# EAGLE design snes-breakout (EAGLE 7.5.0)
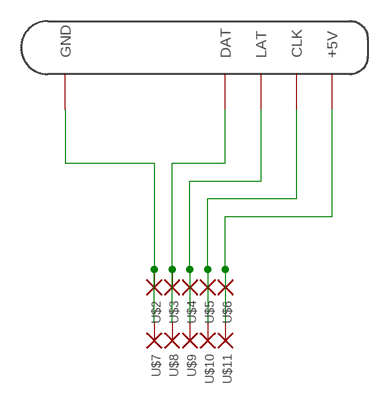
[diagram p0: schematic, sheet 1]

## Parts
U$1  SNES-CONNECTOR  [SNES-CONNECTOR]
U$2  SMDPADSMD6080  [SMD6080]
U$3  SMDPADSMD6080  [SMD6080]
U$4  SMDPADSMD6080  [SMD6080]
U$5  SMDPADSMD6080  [SMD6080]
U$6  SMDPADSMD6080  [SMD6080]
U$7  SMDPADSMD6080  [SMD6080]
U$8  SMDPADSMD6080  [SMD6080]
U$9  SMDPADSMD6080  [SMD6080]
U$10  SMDPADSMD6080  [SMD6080]
U$11  SMDPADSMD6080  [SMD6080]

## Nets
CLK: U$1.P$6(CLK) U$5.P$1(P) U$10.P$1(P)
DAT: U$1.P$4(DAT) U$3.P$1(P) U$8.P$1(P)
GND: U$1.P$1(GND) U$2.P$1(P) U$7.P$1(P)
LAT: U$1.P$5(LAT) U$4.P$1(P) U$9.P$1(P)
VCC: U$1.P$7(+5V) U$6.P$1(P) U$11.P$1(P)

## Library data of the parts
U$1 = munia-breakouts:SNES-CONNECTOR
U$2-U$11 = frank:SMDPAD

## Board
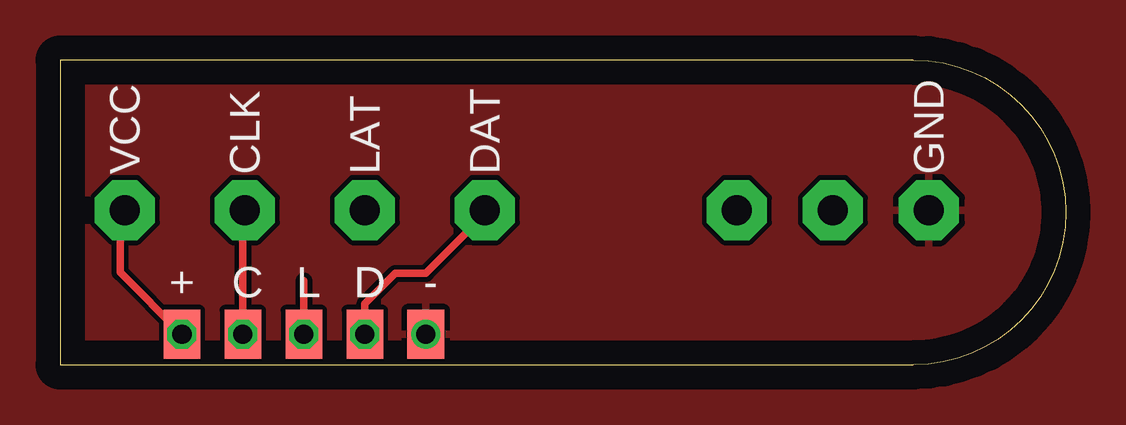
[diagram p1: board, top side]
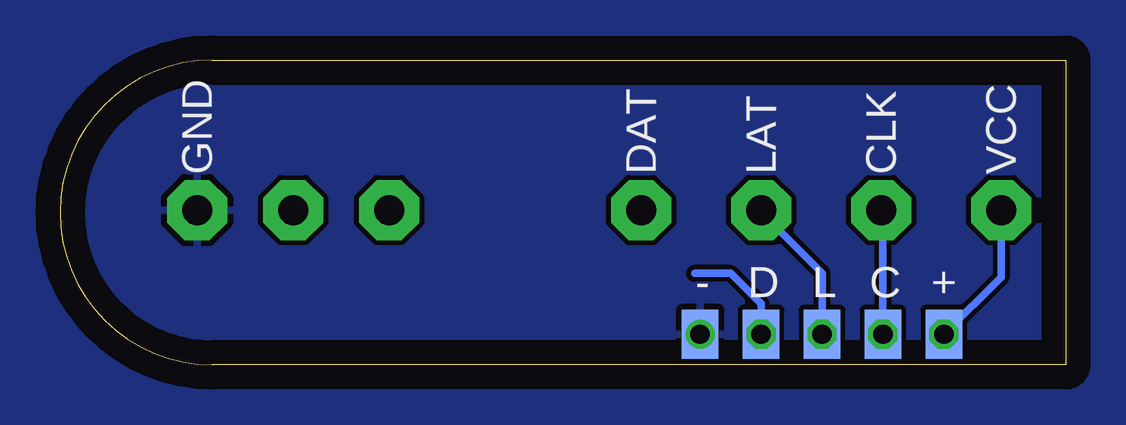
[diagram p2: board, bottom side, seen from below]

Size 41.91 x 12.7 mm. Coordinates in mm from the lower left corner, seen from the top.
Outline: 35.56,12.7 arc-180 35.56,0 0,0 0,12.7 35.56,12.7
Copper layers (1*16): Top 0.035mm / dielectric 1.5mm / Bottom 0.035mm
Design rules "default": minimum track width 10mil, minimum drill 24mil, track to track 8mil, track to pad 8mil, pad to pad 8mil, via to via 8mil, smd to smd 8mil, copper to edge 40mil, drill to drill 8mil, minimum pad ring 10mil, minimum via ring 8mil, stop-mask expansion 4mil, vias tented up to drill 0mil, thermal gap 10mil

### Footprints (pad centres in the part's own frame; a part is rotated, then mirrored left to right if it is on the bottom)
SNES-CONNECTOR = drill 1.25 pad 2.5 octagon: P$1 20,0; P$2 16,0; P$3 12,0; P$4 1.5,0; P$5 -3.5,0; P$6 -8.5,0; P$7 -13.5,0
SMD6080 = smd 1.524 x 2.032: P$1 0,0

### Placement (x,y rotation side)
U$1  16.2,6.44 0 top
U$2  15.24,1.27 0 top
U$3  12.7,1.27 0 top
U$4  10.16,1.27 0 top
U$5  7.62,1.27 0 top
U$6  5.08,1.27 0 top
U$7  15.24,1.27 0 bottom
U$8  12.7,1.27 0 bottom
U$9  10.16,1.27 0 bottom
U$10  7.62,1.27 0 bottom
U$11  5.08,1.27 0 bottom

### Tracks (layer width: path | path; a pad name or v marks a point on that pad's centre or on a via)
CLK  (via drill 0.8)
  Top 0.305: U$10.P$1 7.62,6.36 U$1.P$6
  Bottom 0.305: 7.62,5.96 U$10.P$1
  other vias: 7.62,1.27
DAT  (via drill 0.8)
  Top 0.305: U$8.P$1 12.7,2.54 13.97,3.81 15.24,3.81 17.78,6.35 U$1.P$4
  Bottom 0.305: 15.47,3.81 13.97,3.81 12.7,2.54 U$8.P$1
  other vias: 12.7,1.27
GND
  pour Bottom: -8.89,19.09 48.26,19.09 48.26,-12.66 -8.89,-12.66
  pour Top: -11.43,16.55 48.26,16.55 48.26,-10.12 -11.43,-10.12
LAT  (via drill 0.8)
  Top 0.305: 10.16,3.5 U$9.P$1
  Bottom 0.305: U$9.P$1 10.16,3.81 12.7,6.35 U$1.P$5
  other vias: 10.16,1.27
N$10  (via drill 0.8)
  other vias: 15.24,1.27
VCC  (via drill 0.8)
  Top 0.305: U$11.P$1 2.5,3.85 2.5,6.54
  Bottom 0.305: U$1.P$7 2.7,3.65 U$11.P$1
  other vias: 5.08,1.27

### Text on the board
tPlace: + | C | L | D | D | -
bPlace: + | C | L | D | -
tDocu: (c) 2016 MUNIA.io
bDocu: (c) 2016 MUNIA.io